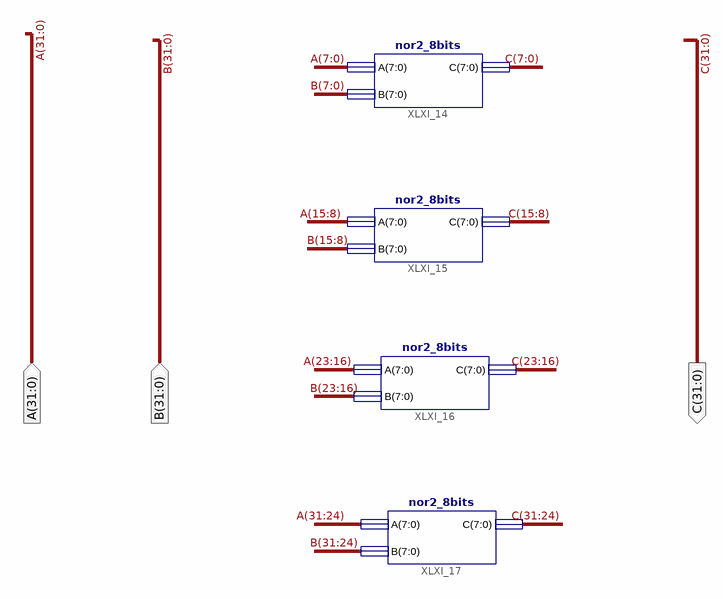
[diagram p0: schematic sheet 1]
// Xilinx ISE schematic nor2_32bits.sch (artix7) as structural Verilog: 4 symbols, 3 ports
module nor2_32bits (
  input  [31:0] A,
  input  [31:0] B,
  output [31:0] C
);

  nor2_8bits XLXI_14 (.A(A[7:0]), .B(B[7:0]), .C(C[7:0]));
  nor2_8bits XLXI_15 (.A(A[15:8]), .B(B[15:8]), .C(C[15:8]));
  nor2_8bits XLXI_16 (.A(A[23:16]), .B(B[23:16]), .C(C[23:16]));
  nor2_8bits XLXI_17 (.A(A[31:24]), .B(B[31:24]), .C(C[31:24]));
endmodule
